# EAGLE design SensorBoard (EAGLE 9.3.2)
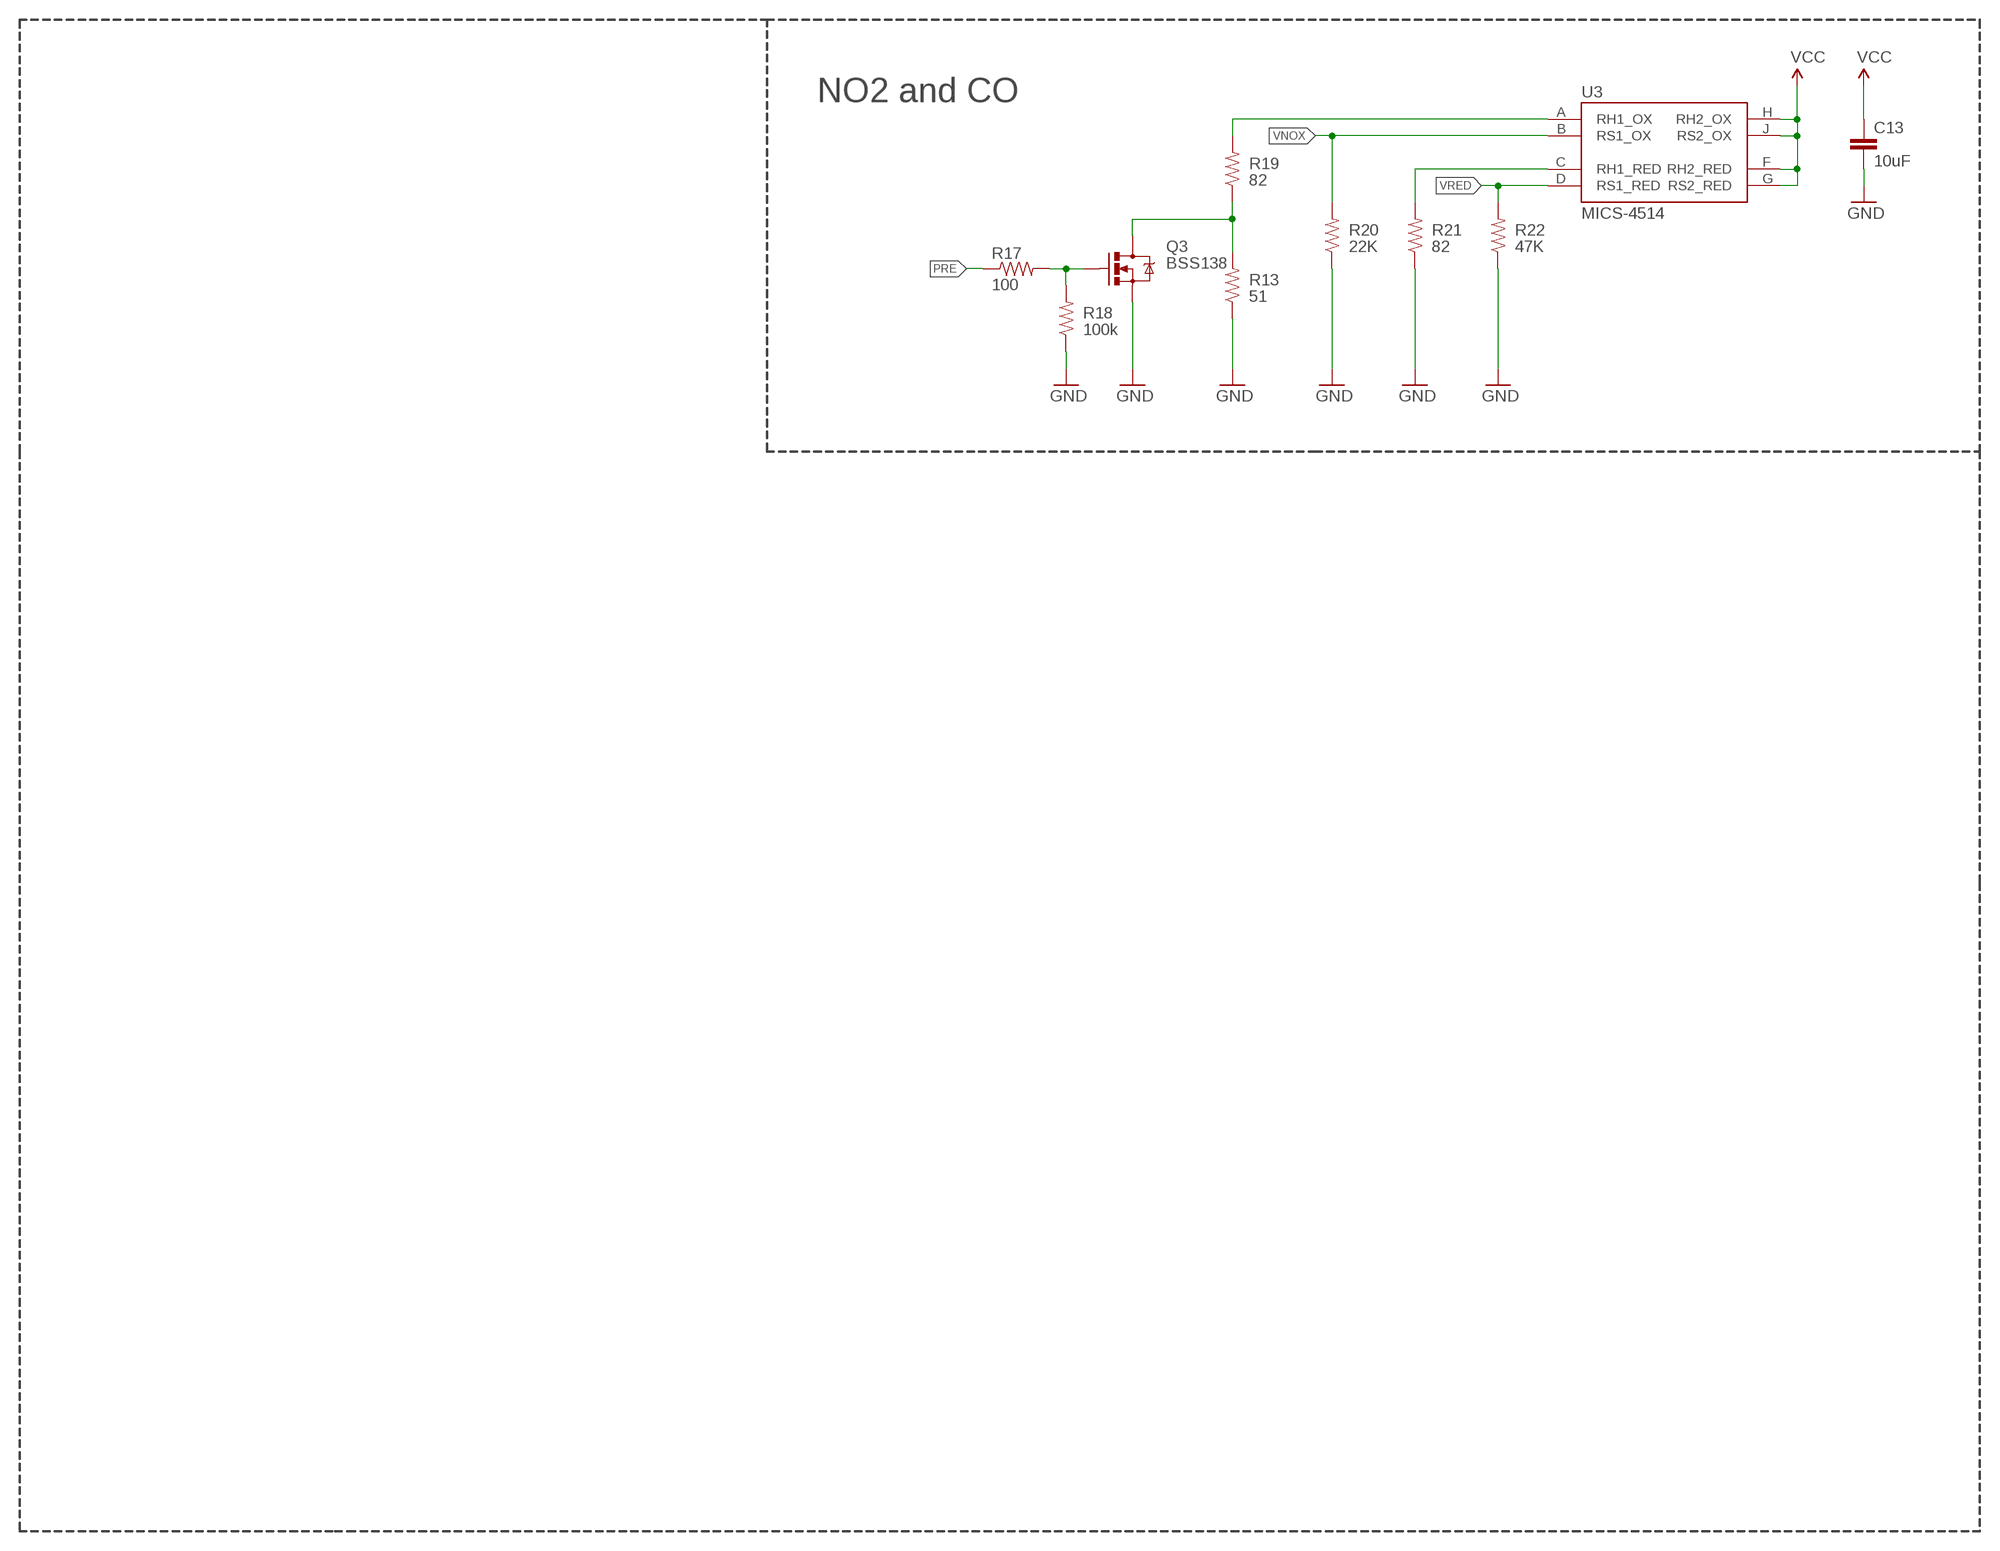
[diagram p0: schematic, sheet 1]

## Parts
C13  10uF  CAP1206  [1206]
Q3  MOSFET-NCHANNELBSS138  [SOT23-3]
R13  51  RESISTOR1206  [1206]
R17  100  100OHM1/10W1%(0603)  [0603-RES]
R18  100k  100KOHM1/10W1%(0603)  [0603-RES]
R19  82  RESISTOR1206  [1206]
R20  22K  22KOHM1/10W1%(0603)  [0603-RES]
R21  82  RESISTOR1206  [1206]
R22  47K  47KOHM1/10W1%(0603)  [0603-RES]
U3  MICS-4514  [MICS_10-SMD]

## Nets
3V3: C13.1 U3.F(RH2_RED) U3.G(RS2_RED) U3.H(RH2_OX) U3.J(RS2_OX) ; supply symbol labelled VCC
GND: C13.2 Q3.2(S) R13.1 R18.1 R20.1 R21.1 R22.1
N$7: Q3.3(D) R13.2 R19.1
N$13: Q3.1(G) R17.2 R18.2
N$15: R19.2 U3.A(RH1_OX)
N$16: R21.2 U3.C(RH1_RED)
PRE: R17.1
VNOX: R20.2 U3.B(RS1_OX)
VRED: R22.2 U3.D(RS1_RED)

## Notes on the sheet
- NO2 and CO

## Library data of the parts
C13 = SparkFun-Capacitors:CAP: Capacitor Standard 0603 ceramic capacitor, and 0.1" leaded capacitor.; PROD_ID: CAP-11330
Q3 = SparkFun-DiscreteSemi:MOSFET-NCHANNEL: Common NMOSFET Parts MFG P/N Store ID Prod ID FDD8780 TRANS-09984 SI7820DN TRANS-11055 FDS6630A IC-08089 2N7002PW TRANS-11151 FQP30N06L COM-10213 TRANS-10060 BSS123LT1G TRANS-08345 BSS138 TRANS-00830 BS170 2N7000; PROD_ID: TRANS-00830; P_NAME: BSS138
R13 = SparkFun-Resistors:RESISTOR: Resistor Basic schematic elements and footprints for 0603, 1206, and PTH resistors.; PROD_ID: RES-12314
R17 = SparkFun-Resistors:100OHM1/10W1%(0603): RES-07863; PROD_ID: RES-07863
R18 = SparkFun-Resistors:100KOHM1/10W1%(0603): RES-07828; PROD_ID: RES-07828
R19 R21 = SparkFun-Resistors:RESISTOR: Resistor Basic schematic elements and footprints for 0603, 1206, and PTH resistors.; DK_ID: 541-82.0CCT-ND
R20 = SparkFun-Resistors:22KOHM1/10W1%(0603): RES-07853; PROD_ID: RES-07853
R22 = SparkFun-Resistors:47KOHM1/10W1%(0603): RES-07871; PROD_ID: RES-07871
U3 = SparkFun-Sensors:MICS-4514: Metal oxide MEMS carbon monoxide (CO) and NOx sensor in an SMD package.; PROD_ID: COMP-12310

## Board
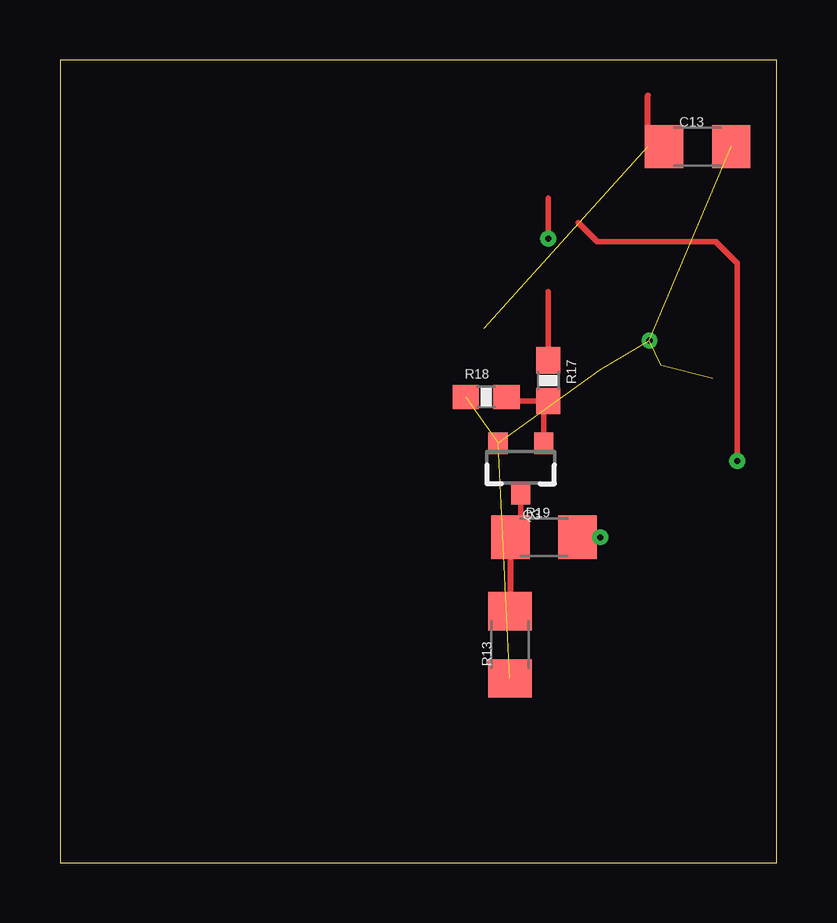
[diagram p1: board, top side]
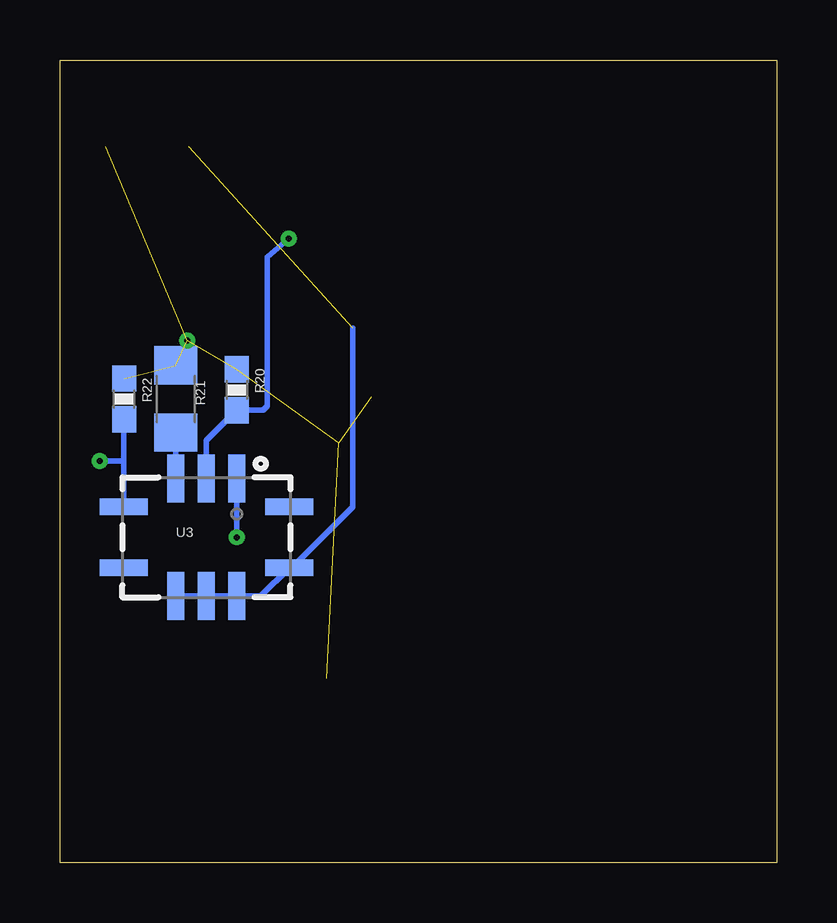
[diagram p2: board, bottom side, seen from below]

Size 29.87 x 33.46 mm. Coordinates in mm from the lower left corner, seen from the top.
Outline: 0,33.47 0,0 29.87,0 29.87,33.47 0,33.47
Copper layers (1*16): Top 0.035mm / dielectric 1.5mm / Bottom 0.035mm
Design rules "default": minimum track width 10mil, minimum drill 24mil, track to track 8mil, track to pad 8mil, pad to pad 8mil, via to via 8mil, smd to smd 8mil, copper to edge 40mil, drill to drill 8mil, minimum pad ring 10mil, minimum via ring 8mil, stop-mask expansion 4mil, vias tented up to drill 0mil, thermal gap 10mil

### Footprints (pad centres in the part's own frame; a part is rotated, then mirrored left to right if it is on the bottom)
1206 = smd 1.6 x 1.8: 1 -1.4,0; 2 1.4,0
SOT23-3 = smd 0.8 x 0.9: 1 -0.95,-1; 2 0.95,-1; 3 0,1.1
0603-RES = smd 1.1 x 1: 1 -0.85,0; 2 0.85,0
MICS_10-SMD = smd 0.7 x 2: A 1.27,2.45; B 0,2.45; C -1.27,2.45; F -1.27,-2.45; G 0,-2.45; H 1.27,-2.45 | smd 2 x 0.7: D -3.45,1.27; E -3.45,-1.27; J 3.45,-1.27; K 3.45,1.27

### Placement (x,y rotation side)
C13  26.57,29.85 0 top
Q3  19.2,16.49 180 top
R13  18.75,9.08 90 top
R17  20.34,20.09 270 top
R18  17.75,19.41 0 top
R19  20.17,13.57 0 top
R20  22.5,19.71 270 bottom
R21  25.04,19.33 270 bottom
R22  27.2,19.33 270 bottom
U3  23.77,13.57 0 bottom

### Tracks (layer width: path | path; a pad name or v marks a point on that pad's centre or on a via)
3V3  (1 unrouted)
  Top 0.229: 25.83,29.69 C13.1
  Top 0.254: C13.1 24.5,29.85 24.5,31.99
  Bottom 0.229: U3.F U3.G U3.H 21.5,11.12 U3.J 20.22,12.3 17.68,14.84 17.68,22.29
GND  (via drill 0.25)  (7 unrouted)
  other vias: 24.56,21.77
N$7
  Top 0.229: Q3.3 19.2,13.63 R19.1
  Top 0.254: R19.1 18.77,10.5 R13.2
N$13
  Top 0.229: Q3.1 20.15,19.05 R17.2 18.77,19.24 R18.2
N$15  (via drill 0.25)
  Top 0.229: R19.2 v22.5,13.57
  Bottom 0.229: v22.5,13.57 U3.A
N$16
  Bottom 0.229: U3.C R21.2
PRE
  Top 0.229: R17.1 20.35,23.8
VNOX  (via drill 0.25)
  Top 0.229: v20.35,26.01 20.35,27.7
  Bottom 0.229: U3.B 23.77,17.59 R20.2 21.4,18.86 21.23,19.03 21.23,25.25 v20.35,26.01
VRED  (via drill 0.25)
  Top 0.229: 21.59,26.67 22.38,25.89 27.33,25.89 28.22,25 v28.22,16.74
  Bottom 0.229: U3.D 27.22,16.74 | 27.22,16.74 27.22,18.46 R22.2 | v28.22,16.74 27.22,16.74